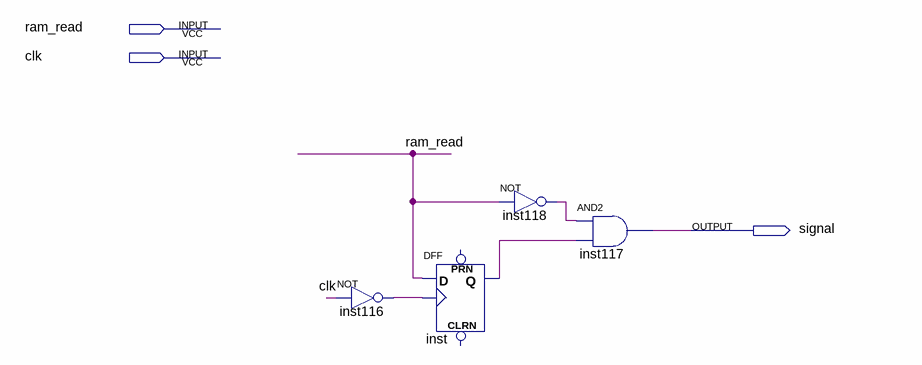
[diagram p0: schematic sheet]
// Quartus schematic test.bdf as structural Verilog: 4 symbols, 3 pins
module test (
  input  ram_read,
  input  clk,
  output signal
);

  wire inst116_out, inst118_out, inst_q;

  not inst116 (inst116_out, clk);
  DFF inst (.CLK(inst116_out), .D(ram_read), .Q(inst_q));  // open: CLRN, PRN
  not inst118 (inst118_out, ram_read);
  and inst117 (signal, inst118_out, inst_q);
endmodule
